# Altium schematic sheet Supply.SchDoc
size A4; Organization: Rotronic AG; Address1: Grindelstrasse 6; Address2: 8303 Bassersdorf; Address3: Switzerland; DocumentNumber: 8; SheetNumber: 8; SheetTotal: 8; Web_Address: www.rotronic.ch; E_Mail_Address: *@rotronic.ch; Fon: +41 (0)44 838 11 11; Fax: +41 (0)44 836 44 24
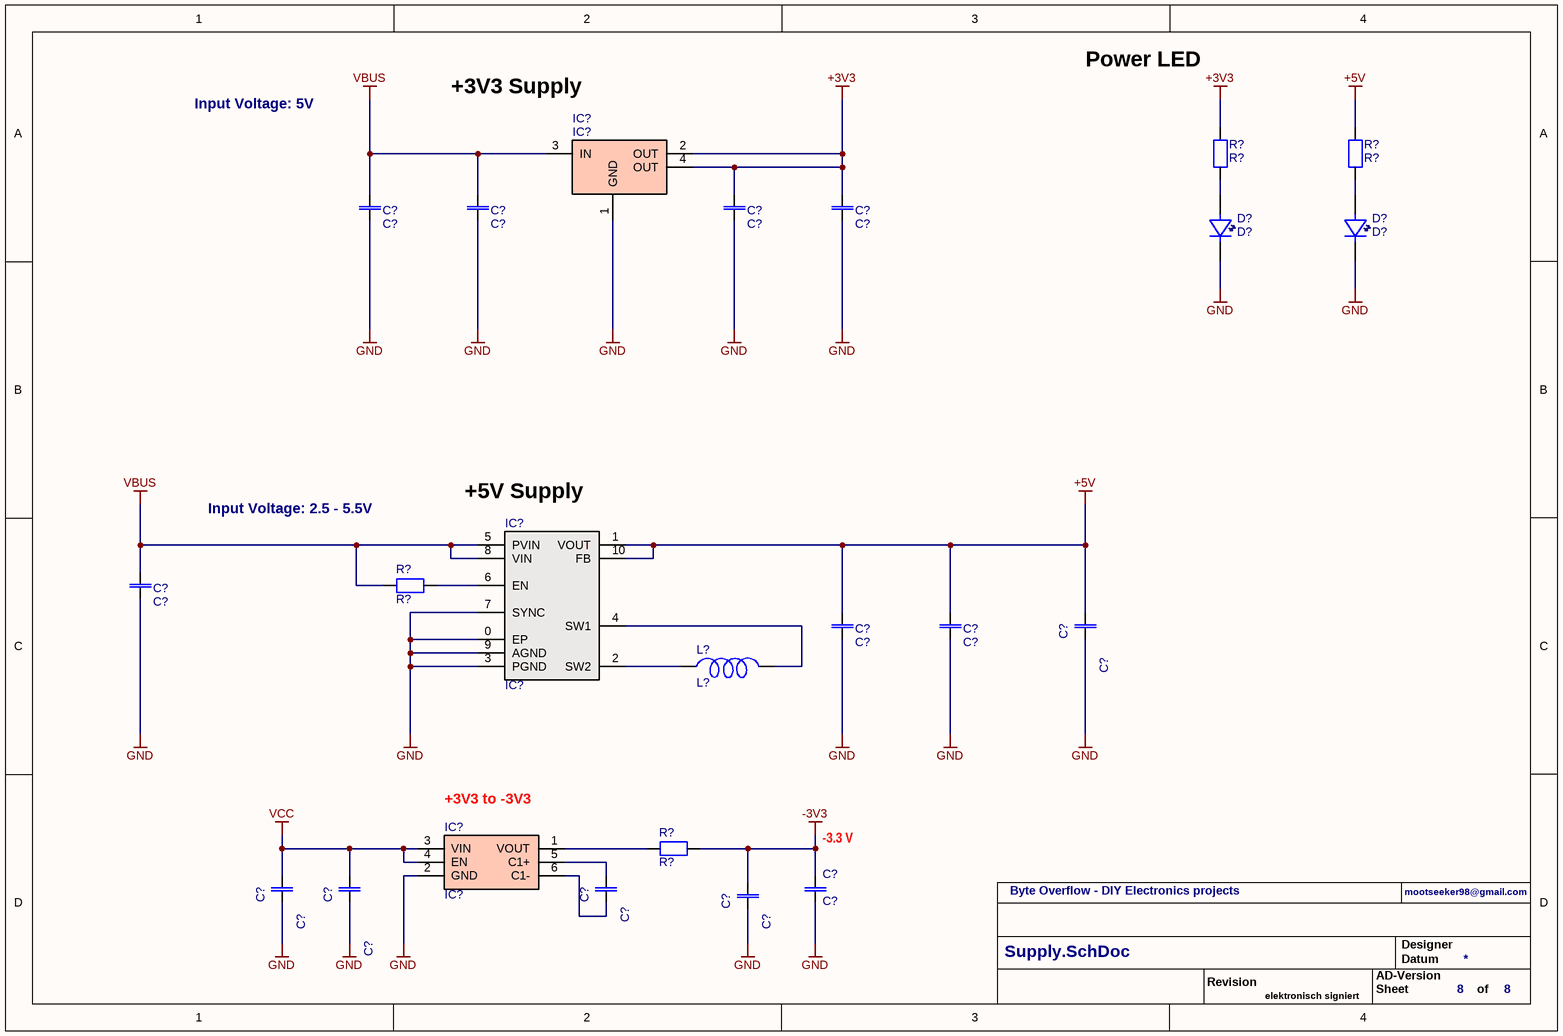
[diagram p0: Supply.SchDoc]

## Parts
(Parts that share a designator on the sheet are numbered #1, #2 ... from top to bottom, then left to right.)
C?#1  C?  [0805-2012]
C?#2  C?  [0805-2012]
C?#3  C?  [0805-2012]
C?#4  C?  [0805-2012]
C?#5  C?  [0805-2012]
C?#6  C?  [0805-2012]
C?#7  C?  [0805-2012]
C?#8  C?  [0805-2012]
C?#9  C?  [0402-1005]
C?#10  C?  [0402-1005]
C?#11  C?  [0402-1005]
C?#12  C?  [0402-1005]
C?#13  C?  [0402-1005]
D?#1  D?  [PLCC-2]
D?#2  D?  [PLCC-2]
IC?#1  IC?  [SOT-223]
IC?#2  IC?  [SON10]
IC?#3  IC?  [SOT-23-6]
L?  L?  [0805-2012]
R?#1  R?  [0805-2012]
R?#2  R?  [0805-2012]
R?#3  R?  [0805-2012]
R?#4  R?  [0603-1608]

## Nets
+3V3: C?#3.1 C?#4.1 IC?#1.2(OUT) IC?#1.4(OUT) R?#1.1
+5V: C?#6.1 C?#7.1 C?#8.1 IC?#2.1(VOUT) IC?#2.10(FB) R?#2.1
-3V3: C?#12.1 C?#13.1 R?#4.2
GND: C?#1.2 C?#2.2 C?#3.2 C?#4.2 C?#5.2 C?#6.2 C?#7.2 C?#8.2 C?#9.2 C?#10.2 C?#12.2 C?#13.2 D?#1.2(K) D?#2.2(K) IC?#1.1(GND) IC?#2.0(EP) IC?#2.3(PGND) IC?#2.7(SYNC) IC?#2.9(AGND) IC?#3.2(GND)
VBUS: C?#1.1 C?#2.1 C?#5.1 IC?#1.3(IN) IC?#2.5(PVIN) IC?#2.8(VIN) R?#3.1
VCC: C?#9.1 C?#10.1 IC?#3.3(VIN) IC?#3.4(EN)
NetC?#11_1: C?#11.1 IC?#3.5(C1+)
NetC?#11_2: C?#11.2 IC?#3.6(C1-)
NetD?#1_1: D?#1.1(A) R?#1.2
NetD?#2_1: D?#2.1(A) R?#2.2
NetIC?#2_2: IC?#2.2(SW2) L?.1
NetIC?#2_4: IC?#2.4(SW1) L?.2
NetIC?#2_6: IC?#2.6(EN) R?#3.2
NetIC?#3_1: IC?#3.1(VOUT) R?#4.1

## Notes on the sheet
- Input Voltage: 5V
- +3V3 Supply
- Power LED
- Input Voltage: 2.5 - 5.5V
- (near IC?#2) +5V Supply
- (near IC?#3) +3V3 to -3V3
- (near C?#12) -3.3 V
- Byte Overflow - DIY Electronics projects
- mootseeker98@gmail.com
- Revision
- AD-Version
- Designer
- Datum
- elektronisch signiert
- Sheet
- of

## Library data of the parts
C?#1 C?#3 = F0127: Capacitor; Part-Number: 63.0105.1500; Manufacturer: Murata Electronics North America; Manufacturer Part Number: GRM21BF51H105ZA12L; Designator: C 1uF 50V; ID: F0127; Operating Range: -30°C to +85°C; Note: 1uF 50V Y5V 20% Murata GRM21BF51H105ZA12L; Specification: 27.12.2012 OPT; Value: 1uF 50V; Component Type: Standard; ComponentLink1Description: Datasheet; ComponentLink1URL: http://www.murata.com/products/catalog/pdf/c02e.pdf; Status: Active; Availability Date: 15.11.2016 OPT; RoHS compliant: Yes; Flammability: n.a.; ComponentLink2Description: http://search.murata.co.jp/Ceramy/image/img/A01X/G101/ENG/GRM21BF51H105ZA12-01.pdf; ComponentLink2URL: http://search.murata.co.jp/Ceramy/image/img/A01X/G101/ENG/GRM21BF51H105ZA12-01.pdf; Pin Count: 2; Price 100: 0.067; Price 1000: 0.067; Price Date: 02.12.2019 Pro Alpha; Changed: 27.12.2012 OPT; Price: 0.118; Supplier 1: Digi-Key; Supplier Part Number 1: 490-3903-1-ND; Part Status: Discontinued at Digi-Key; RoHS: RoHS Compliant
C?#2 C?#4 = F0032: Capacitor; Part-Number: 63.0104.1000; Manufacturer: KEMET; Manufacturer Part Number: C0805C104K5RACTU; Designator: C 0.1uF 50V; ID: F0032; Operating Range: -55°C to +125°C; Note: 0.1uF 10% 50V X7R AVX 08055C104KAT2A; Specification: 19.09.2011 MLP; Verification: 05.07.2012 OPT; Value: 0.1uF 50V; Component Type: Standard; ComponentLink1Description: http://www.kemet.com/docfinder?Partnumber=C0805C104K5RACTU; ComponentLink1URL: http://www.kemet.com/docfinder?Partnumber=C0805C104K5RACTU; Status: Active; Availability Date: 15.11.2016 OPT; RoHS compliant: Yes; Flammability: n.a.; Pin Count: 2; Price 100: 0.011; Price 1000: 0.011; Price Date: 02.12.2019 Pro Alpha; Changed: 19.09.2011 MLP; Price: 0.015; Supplier 1: Digi-Key; Supplier Part Number 1: 399-1170-1-ND; Part Status: Active; RoHS: RoHS Compliant
C?#5-C?#7 = F0002: Capacitor; Part-Number: 63.7000.0120; Manufacturer: AVX Corporation; Manufacturer Part Number: 0805YD106KAT2A; Designator: C 10uF 16V; ID: F0002; Operating Range: -55°C to +85°C; Note: 10uF 10% 16V X5R AVX 0805YD106KAT2A; Specification: 10.11.2011 MLP; Verification: 05.07.2012 OPT; Value: 10uF 16V; Component Type: Standard; ComponentLink1Description: Datasheet; ComponentLink1URL: http://www.murata.com/products/catalog/pdf/c02e.pdf; Status: Active; Availability Date: 15.11.2016 OPT; RoHS compliant: Yes; Flammability: n.a.; ComponentLink2Description: http://datasheets.avx.com/cx5r.pdf; ComponentLink2URL: http://datasheets.avx.com/cx5r.pdf; Pin Count: 2; Price 100: 0.087; Price 1000: 0.068; Price Date: 02.12.2019 Pro Alpha; Changed: 10.11.2011 MLP; Price: 0.062; Supplier 1: Digi-Key; Supplier Part Number 1: 478-5165-1-ND; Part Status: Active; RoHS: RoHS Compliant
C?#8 = F0123: Capacitor; Part-Number: 63.0104.1500; Manufacturer: KEMET; Manufacturer Part Number: C0805C104M5RACTU; Designator: C 100nF 50V; ID: F0123; Operating Range: -40°C to +85°C; Note: 100nF 50V X7R 20% AVX 08055C104MAT2A; Specification: 21.12.2012 OPT; Value: 100nF 50V; Component Type: Standard; ComponentLink1Description: Datasheet; ComponentLink1URL: http://avx.com/docs/Catalogs/cx7r.pdf; Status: Active; Availability Date: 15.11.2016 OPT; RoHS compliant: Yes; Flammability: n.a.; ComponentLink2Description: http://www.kemet.com/docfinder?Partnumber=C0805C104M5RACTU; ComponentLink2URL: http://www.kemet.com/docfinder?Partnumber=C0805C104M5RACTU; Pin Count: 2; Price 100: 0.014; Price 1000: 0.014; Price Date: 02.12.2019 Pro Alpha; Changed: 21.12.2012 OPT; Price: 0.026; Supplier 1: Digi-Key; Supplier Part Number 1: 399-1169-1-ND; Part Status: Active; RoHS: RoHS Compliant
C?#9 C?#13 = F0101: Capacitor; Part-Number: 63.7000.0150; Manufacturer: Johanson Dielectrics Inc.; Manufacturer Part Number: 6R3R07X225MV4T; Designator: C 2.2uF 6.3V; ID: F0101; Operating Range: -55°C to +85°C; Note: 2.2uF 6.3V 20% X5R Johanson Dielectrics 6R3R07X225MV4T; Specification: 14.11.2014 OPT; Value: 2.2uF 6.3V; Component Type: Standard; ComponentLink1Description: Datasheet; ComponentLink1URL: http://www.mouser.com/ds/2/611/JDI_Tanceram_High-Cap-2013-04-242302.pdf; Pin Count: 2; Price 100: 0.093; Price 1000: 0.074; Price Date: 01.06.2021 Pro Alpha; Changed: 14.11.2014 OPT; Price: 0.078; Availability Date: 15.11.2016 OPT; Flammability: n.a.; RoHS compliant: Yes; Status: Active; ComponentLink2Description: https://www.johansondielectrics.com/downloads/JDI-Tanceram.pdf; ComponentLink2URL: https://www.johansondielectrics.com/downloads/JDI-Tanceram.pdf; Part Status: Active; RoHS: RoHS Compliant; Supplier Part Number 1: 709-1223-1-ND; Supplier: Digi-Key
C?#10 C?#12 = F0216: Capacitor; Part-Number: 63.0104.1505; Manufacturer: Murata Electronics North America; Manufacturer Part Number: GCM155R71H104KE02D; ID: F0216; Operating Range: -55°C to +125°C; Note: 100nF 50V X7R 10% Murata GCM155R71H104KE02D; Specification: 22.07.2016 OPT; Value: 100nF 50V; Designator: C 100nF 50V X7R; Component Type: Standard; ComponentLink1Description: Datasheet; ComponentLink1URL: http://www.murata.com/~/media/webrenewal/support/library/catalog/products/capacitor/mlcc/c02e.pdf; Pin Count: 2; Price 100: 0.007; Price 1000: 0.004; Price Date: 01.06.2021 Pro Alpha; Changed: 22.07.2016 OPT; Price: 0.013; Availability Date: 15.11.2016 OPT; Flammability: n.a.; RoHS compliant: Yes; Status: Active; Part Status: Active; RoHS: RoHS Compliant; Supplier Part Number 1: 490-10700-1-ND; Supplier: Digi-Key
C?#11 = F0091: Capacitor; Part-Number: 63.7000.0020; Manufacturer: KEMET; Manufacturer Part Number: C0402C105K9PACTU; Designator: C 1uF 6.3V; ID: F0091; Operating Range: -55°C to +125°C; Note: 1uF X5R 6.3V 10% Taiyo Yuden JMK105BJ105KV-F; Specification: 19.09.2011 MLP; Verification: 05.07.2012 OPT; Value: 1uF 6.3V; Component Type: Standard; Pin Count: 2; Price 100: 0.004; Price 1000: 0.004; Price Date: 01.06.2021 Pro Alpha; Changed: 19.09.2011 MLP; Price: 0.005; Availability Date: 15.11.2016 OPT; Flammability: n.a.; RoHS compliant: Yes; Status: Active; ComponentLink1Description: http://www.kemet.com/docfinder?Partnumber=C0402C105K9PACTU; ComponentLink1URL: http://www.kemet.com/docfinder?Partnumber=C0402C105K9PACTU; Part Status: Active; RoHS: RoHS Compliant; Supplier Part Number 1: 399-4873-1-ND; Supplier: Digi-Key
D?#1 D?#2 = A0146: LED; Part-Number: 00.0000.0000; Manufacturer: OSRAM Opto Semiconductors; Manufacturer Part Number: LST67K-J1L2-1-Z; Designator: LS T67K-J1L2-1-Z; ID: A0146; Operating Range: -55°C to +150°C; Note: Standard-LEDs - SMD Super Red, 630nm 18mcd, 2mA LS T67K-J1L2-1-Z; Value: LED Rot; Changed: 26.05.2021 PEK; Component Type: Standard; ComponentLink1Description: Datasheet; ComponentLink1URL: https://dammedia.osram.info/media/resource/hires/osram-dam-5522870/LS%20T67K_EN.pdf; Status: Active; Availability Date: 26.05.2021 PEK; RoHS compliant: Yes; Flammability: n.a.; Pin Count: 2; Price 100: 0.10; Price 1000: 0.064; Price: 0.35; Price Date: 26.05.2021 PEK; Supplier: Mouser; Supplier Part Number: 720-LST67K-J1L2-1-Z; Part Status: Active; RoHS: RoHS Compliant
IC?#1 = K0059: Voltage regulator; Part-Number: 00.0000.0000; Manufacturer: Texas Instruments; Manufacturer Part Number: TLV1117LV33DCYR; Designator: TLV1117LV33DCY; ID: K0059; Operating Range: -40°C to +125°C; Note: Ti TLV1117LV33DCY 3.3V 1A pos. fixed Voltage LDO; Changed: 14.09.2016 OPT; Value: TLV1117LV33DCY; Component Type: Standard; ComponentLink1Description: Datasheet; ComponentLink1URL: http://www.ti.com/lit/ds/symlink/tlv1117lv.pdf; Status: Active; Availability Date: 14.09.2016 OPT; RoHS compliant: Yes; Flammability: n.a.; Pin Count: 4; Price 100: 0.33; Price 1000: 0.265; Price Date: 14.09.2016 OPT; Specification: 14.09.2016 OPT; Price: 0.607; Supplier 1: Digi-Key; Supplier Part Number 1: 296-28778-1-ND; Part Status: Active; RoHS: RoHS Compliant
IC?#2 = K0067: Voltage regulator; Part-Number: 00.0000.0000; Manufacturer: Analog Devices; Manufacturer Part Number: 584-ADP2503ACPZ5.0R7; Designator: ADP2503ACPZ-5.0-R7; ID: K0067; Operating Range: -40°C to +125°C; Note: Schaltspannungsregler 5V 600mA, Buck Boost Converter; Changed: 27.10.2022 PEK; Value: ADP2503ACPZ-5.0-R7; Component Type: Standard; ComponentLink1Description: Datasheet; ComponentLink1URL: https://www.mouser.ch/datasheet/2/609/ADP2503_2504-1503443.pdf; Status: Active; Availability Date: 27.10.2022 PEK; RoHS compliant: Yes; Flammability: n.a; Pin Count: 10; Price 100: 3.70; Price 1000: 2.68; Price Date: 27.10.2022 PEK; Specification: 27.10.2022 PEK; Price: 5.04; Supplier 1: Mouser; Supplier Part Number 1: 584-ADP2503ACPZ5.0R7; Part Status: Active; RoHS: RoHS Compliant
IC?#3 = K0046: Voltage regulator; Part-Number: 61.2776.3200; Manufacturer: Texas Instruments; ID: K0046; Operating Range: -40°C to +85°C; Note: Ti LM2776DBVT switched capacitor inverter; Changed: 12.08.2015 OPT; Value: LM2776DBVT; Designator: LM2776DBVT; Component Type: Standard; ComponentLink1Description: Datasheet; ComponentLink1URL: http://www.ti.com/lit/ds/symlink/lm2776.pdf; Pin Count: 6; Price 100: 0.95; Price 1000: 0.46; Price Date: 01.06.2021 Pro Alpha; Specification: 12.08.2015 OPT; Price: 0.659; Availability Date: 15.11.2016 OPT; Flammability: n.a.; RoHS compliant: Yes; Status: Active; Manufacturer Part Number: LM2776DBVT; Part Status: Active; RoHS: RoHS Compliant; Supplier Part Number 1: 296-42300-1-ND; Supplier: Digi-Key
L? = M0085: Inductor; Part-Number: 00.0000.0000; Manufacturer: TDK; Manufacturer Part Number: ADL2012-1R5M-T01; Designator: L 1.5uH 0.5A; ID: M0085; Operating Range: -40°C to +125°C; Note: Festinduktivitäten 1.5uH 10% 0.56A CWF2414; Specification: 27.10.2022 PEK; Value: L 1.5uH 0.5A; Component Type: Standard; ComponentLink1Description: Datasheet; ComponentLink1URL: https://product.tdk.com/system/files/dam/doc/product/inductor/inductor/smd/catalog/inductor_automotive_decoupling_adl2012_en.pdf; Status: Active; Availability Date: 27.10.2022 PEK; RoHS compliant: Yes; Flammability: n.a.; Pin Count: 2; Price 100: 0.37; Price 1000: 0.26; Price Date: 27.10.2022 PEK; Changed: 27.10.2022 PEK; Price: 0.62; Supplier 1: Mouser; Supplier Part Number 1: 810-ADL2012-1R5M-T01; Part Status: Active; RoHS: RoHS Compliant
R?#1 = Q0422: Resistor; Part-Number: 00.0000.0000; Manufacturer: Panasonic Electronic Components; Manufacturer Part Number: ERJ-6ENF5600V; Designator: R 560E 1%; ID: Q0422; Operating Range: -55°C to +155°C; Note: Dickfilmwiderstände - SMD 0805 560ohms 1% AEC-Q200 ERJ-6ENF5600V; Changed: 15.11.2019 PEK; Value: 560E 1%; Component Type: Standard; ComponentLink1Description: Datasheet; ComponentLink1URL: https://www.mouser.ch/datasheet/2/315/AOA0000C304-1149620.pdf; Status: Active; Availability Date: 15.11.2019 PEK; RoHS compliant: Yes; Flammability: n.a.; Pin Count: 2; Price 100: 0.03; Price 1000: 0.011; Price Date: 15.11.2019 PEK; Specification: 15.11.2019 PEK; Price: 0.098; Supplier: Mouser; Supplier Part Number: 667-ERJ-6ENF5600V; Part Status: Active; RoHS: RoHS Compliant
R?#2 = Q0459: Resistor; Part-Number: 00.0000.0000; Manufacturer: Bourns; Manufacturer Part Number: CR0805-JW-821EPF; Designator: R 820E 1%; ID: Q0459; Operating Range: -55°C to +155°C; Note: Dickfilmwiderstände - SMD 1/8W 820E 1% CR0805-JW-821EPF; Changed: 25.05.2021 PEK; Value: 820E 1% 1/8W; Component Type: Standard; ComponentLink1Description: Datasheet; ComponentLink1URL: https://www.mouser.ch/datasheet/2/54/cr-pf-1858353.pdf; Status: Active; Availability Date: 25.05.2021 PEK; RoHS compliant: Yes; Flammability: n.a.; Pin Count: 2; Price 100: 0.022; Price 1000: 0.009; Price Date: 25.05.2021 PEK; Price: 0.094; Supplier: Mouser; Supplier Part Number: 652-CR0805-JW-821EPF; Part Status: Active; RoHS: RoHS Compliant
R?#3 = Q0244: Resistor; Part-Number: 71.0000.0500; Manufacturer: Vishay Dale; Manufacturer Part Number: CRCW08050000Z0EAHP; Designator: R 0E 1%; ID: Q0244; Operating Range: -55°C to +155°C; Note: 0E 1.0% Vishay/Dale CRCW08050000Z0EA; Changed: 23.04.2013 OPT; Verification: 05.03.2013 ENP; Value: 0E 1%; Component Type: Standard; ComponentLink1Description: Datasheet; ComponentLink1URL: http://www.mouser.com/ds/2/427/dcrcwe3-109170.pdf; Status: Active; Availability Date: 16.11.2016 OPT; RoHS compliant: Yes; Flammability: n.a.; ComponentLink2Description: http://www.vishay.com/docs/20043/crcwhpe3.pdf; ComponentLink2URL: http://www.vishay.com/docs/20043/crcwhpe3.pdf; Pin Count: 2; Price 100: 0.007; Price 1000: 0.007; Price Date: 02.12.2019 Pro Alpha; Specification: 23.04.2013 OPT; Price: 0.005; Supplier: Digi-Key; Supplier Part Number: 541-0.0TBCT-ND; Part Status: Active; RoHS: RoHS Compliant
R?#4 = Q0389: Resistor; Part-Number: 71.1009.1500; Manufacturer: Vishay Dale; Manufacturer Part Number: CRCW060310R0FKEA; Designator: R 10E 1%; ID: Q0389; Operating Range: -55°C to +155°C; Note: 10E 1% 100ppm 1/10W Vishay CRCW060310R0FKEA; Changed: 21.09.2016 OPT; Verification: 26.09.2016 ENP; Value: 10E 1%; Component Type: Standard; ComponentLink1Description: Datasheet; ComponentLink1URL: http://www.vishay.com/docs/20035/dcrcwe3.pdf; Status: Active; Availability Date: 21.09.2016 OPT; RoHS compliant: Yes; Flammability: n.a.; Pin Count: 2; Price 100: 0.026; Price 1000: 0.018; Price Date: 01.06.2021 Pro Alpha; Specification: 21.09.2016 OPT; Price: 0.043; Supplier: Digi-Key; Supplier Part Number: 541-10.0HCT-ND; Part Status: Active; RoHS: RoHS Compliant